# EAGLE design tusb wiggler - b conn (EAGLE 6.3)
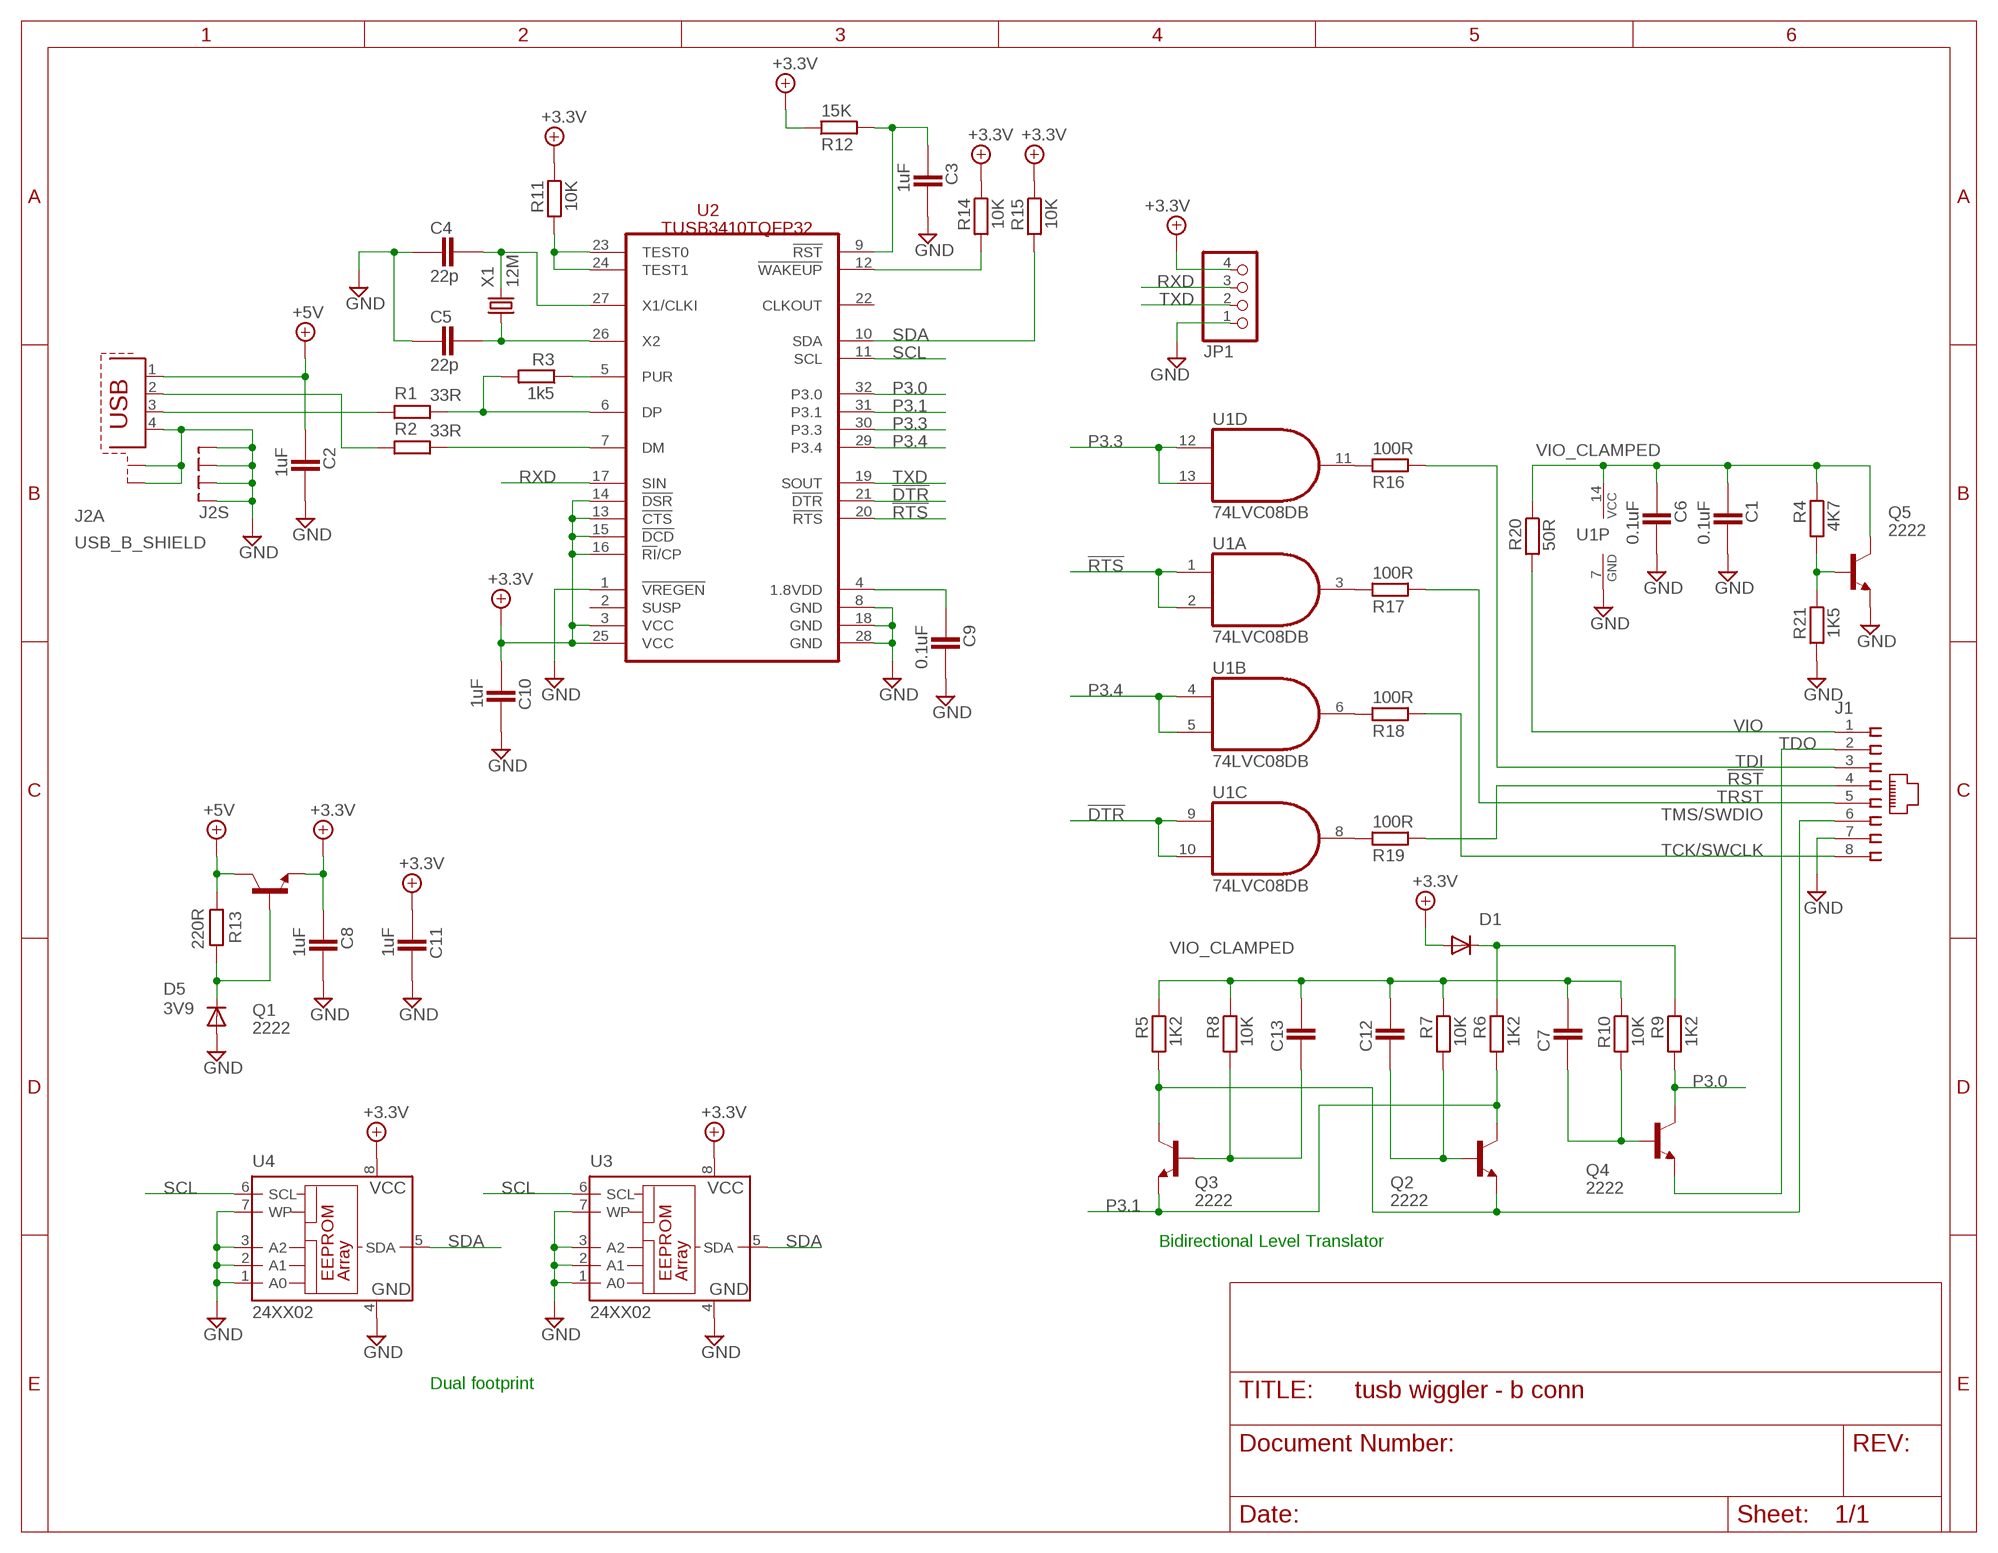
[diagram p0: schematic, sheet 1]

## Parts
C1  0.1uF  CAPACITOR_1206  [CAPC3215X168N]
C2  1uF  CAPACITOR_0603  [CAPC1608X92N]
C3  1uF  CAPACITOR_0603  [CAPC1608X92N]
C4  22p  CAPACITOR_0805N  [CAP2012X70N]
C5  22p  CAPACITOR_0805N  [CAP2012X70N]
C6  0.1uF  CAPACITOR_0603  [CAPC1608X92N]
C7  CAPACITOR_0805N  [CAP2012X70N]
C8  1uF  CAPACITOR_0603  [CAPC1608X92N]
C9  0.1uF  CAPACITOR_0805N  [CAP2012X70N]
C10  1uF  CAPACITOR_0603  [CAPC1608X92N]
C11  1uF  CAPACITOR_0603  [CAPC1608X92N]
C12  CAPACITOR_0805N  [CAP2012X70N]
C13  CAPACITOR_0805N  [CAP2012X70N]
D1  DIODE-SOD110-W  [SOD110-W]
D5  3V9  DIODE-MELF-MLL41  [MELF-MLL41]
J1  520426-4  [520426-4]
J2  USB_B_SHIELD  [PN61729-S]
JP1  PINHD-1X4_2.54  [1X04]
Q1  2222  NPN_SOT-23  [SOT95P280X135-3N]
Q2  2222  NPN_SOT-23  [SOT95P280X135-3N]
Q3  2222  NPN_SOT-23  [SOT95P280X135-3N]
Q4  2222  NPN_SOT-23  [SOT95P280X135-3N]
Q5  2222  NPN_SOT-23  [SOT95P280X135-3N]
R1  33R  RESISTOR_0603  [RESC1608X55N]
R2  33R  RESISTOR_0603  [RESC1608X55N]
R3  1k5  RESISTOR_0603  [RESC1608X55N]
R4  4K7  RESISTOR_0603  [RESC1608X55N]
R5  1K2  RESISTOR_0603  [RESC1608X55N]
R6  1K2  RESISTOR_0603  [RESC1608X55N]
R7  10K  RESISTOR_0603  [RESC1608X55N]
R8  10K  RESISTOR_0603  [RESC1608X55N]
R9  1K2  RESISTOR_0603  [RESC1608X55N]
R10  10K  RESISTOR_0603  [RESC1608X55N]
R11  10K  RESISTOR_0603  [RESC1608X55N]
R12  15K  RESISTOR_0603  [RESC1608X55N]
R13  220R  RESISTOR_0603  [RESC1608X55N]
R14  10K  RESISTOR_0603  [RESC1608X55N]
R15  10K  RESISTOR_0603  [RESC1608X55N]
R16  100R  RESISTOR_1206  [RESC3115X70N]
R17  100R  RESISTOR_1206  [RESC3115X70N]
R18  100R  RESISTOR_1206  [RESC3115X70N]
R19  100R  RESISTOR_1206  [RESC3115X70N]
R20  50R  RESISTOR_0603  [RESC1608X55N]
R21  1K5  RESISTOR_0603  [RESC1608X55N]
U1  74LVC08DB  7408DB  [TSSOP14]
U2  TUSB3410TQFP32  [TQFP32-08]
U3  24XX02  24AA64ST  [TSSOP8]
U4  24XX02  24AA64SN  [SO-08]
X1  12M  CRYSTALHC49UP  [HC49UP]

## Nets
!DTR: U1.9(C:I0) U1.10(C:I1) U2.21(!DTR)
!RST: J1.4 R19.2
!RTS: U1.1(A:I0) U1.2(A:I1) U2.20(!RTS)
+3.3V: C8.1 C10.1 C11.1 D1.A JP1.4 Q1.2(E) R11.1 R12.1 R14.1 R15.1 U2.3(VCC) U2.13(!CTS) U2.14(!DSR) U2.15(!DCD) U2.16(!RI!/CP) U2.25(VCC) U3.8(VCC) U4.8(VCC)
+5V: C2.1 J2.1 Q1.3(C) R13.1
GND: C1.2 C2.2 C3.2 C4.1 C5.1 C6.2 C8.2 C9.2 C10.2 C11.2 D5.A J1.7 J2.4 J2.G1(A:S1) J2.G2(S:S1) J2.G3(S:S2) J2.G4(A:S2) J2.G5(S:S3) J2.G6(S:S4) JP1.1 Q5.2(E) R21.2 U1.7(P:GND) U2.1(!VREGEN) U2.8(GND) U2.18(GND) U2.28(GND) U3.1(A0) U3.2(A1) U3.3(A2) U3.4(GND) U3.7(WP) U4.1(A0) U4.2(A1) U4.3(A2) U4.4(GND) U4.7(WP)
N$2: J2.3 R1.1
N$4: C12.1 Q2.1(B) R7.2
N$6: C7.1 Q4.1(B) R10.2
N$7: C13.1 Q3.1(B) R8.2
N$8: R19.1 U1.8(C:O)
N$9: R11.2 U2.23(TEST0) U2.24(TEST1)
N$10: C3.1 R12.2 U2.9(!RST)
N$11: R16.1 U1.11(D:O)
N$12: R17.1 U1.3(A:O)
N$13: R18.1 U1.6(B:O)
N$14: Q5.1(B) R4.2 R21.1
N$15: D1.C R6.1 R9.1
N$17: R14.2 U2.12(!WAKEUP)
N$18: J2.2 R2.1
N$22: R1.2 R3.2 U2.6(DP)
N$23: R2.2 U2.7(DM)
N$24: D5.C Q1.1(B) R13.2
N$25: C4.2 U2.27(X1/CLKI) X1.2
N$26: C5.2 U2.26(X2) X1.1
N$29: C9.1 U2.4(1.8VDD)
N$30: R3.1 U2.5(PUR)
P3.0: Q4.3(C) R9.2 U2.32(P3.0)
P3.1: Q2.3(C) Q3.2(E) R6.2 U2.31(P3.1)
P3.3: U1.12(D:I0) U1.13(D:I1) U2.30(P3.3)
P3.4: U1.4(B:I0) U1.5(B:I1) U2.29(P3.4)
RXD: JP1.3 U2.17(SIN)
SCL: U2.11(SCL) U3.6(SCL) U4.6(SCL)
SDA: R15.2 U2.10(SDA) U3.5(SDA) U4.5(SDA)
TCK/SWCLK: J1.8 R18.2
TDI: J1.3 R16.2
TDO: J1.2 Q4.2(E)
TMS/SWDIO: J1.6 Q2.2(E) Q3.3(C) R5.2
TRST: J1.5 R17.2
TXD: JP1.2 U2.19(SOUT)
VIO: J1.1 R20.2
VIO_CLAMPED: C1.1 C6.1 C7.2 C12.2 C13.2 Q5.3(C) R4.1 R5.1 R7.1 R8.1 R10.1 R20.1 U1.14(P:VCC)
Unconnected: U2.2(SUSP) U2.22(CLKOUT)

## Notes on the sheet
- Bidirectional Level Translator
- Dual footprint

## Library data of the parts
C1-C13 = ipc-7351-capacitor:CAPACITOR_
D1 D5 = diode:DIODE-: DIODE
J1 = con-amp:520426-4: AMP connector
J2 = Misc Conn:USB_B_SHIELD
JP1 = pinhead-1:PINHD-1X4: PIN HEADER
Q1-Q5 = ipc-7351-transistor:NPN_
R1-R21 = ipc-7351-resistor:RESISTOR_
U1 = Misc Logic:74*08: Quad 2-input AND gate
U2 = tusb3x10-1:TUSB3410: USB Controller full RS232 , IrDA, RS485 , 4 I/O integrated 8052 microcontroller 16kB RAM code , 2kB RAM data
U3 U4 = microchip:24*: Serial EEPROM I2C
X1 = crystal:CRYSTAL: CRYSTAL

## Board
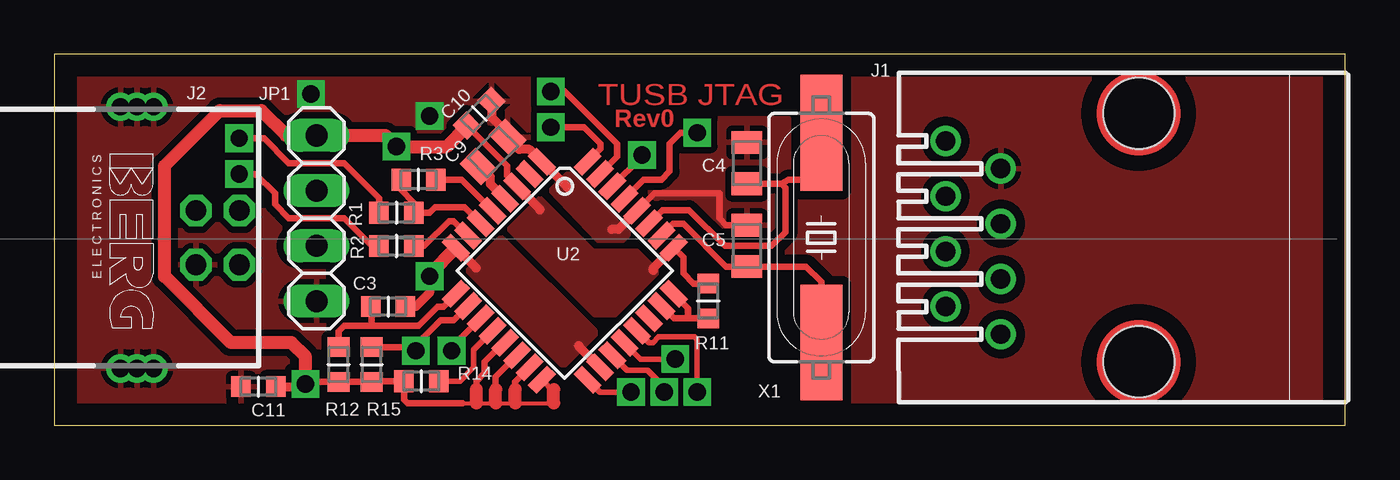
[diagram p1: board, top side]
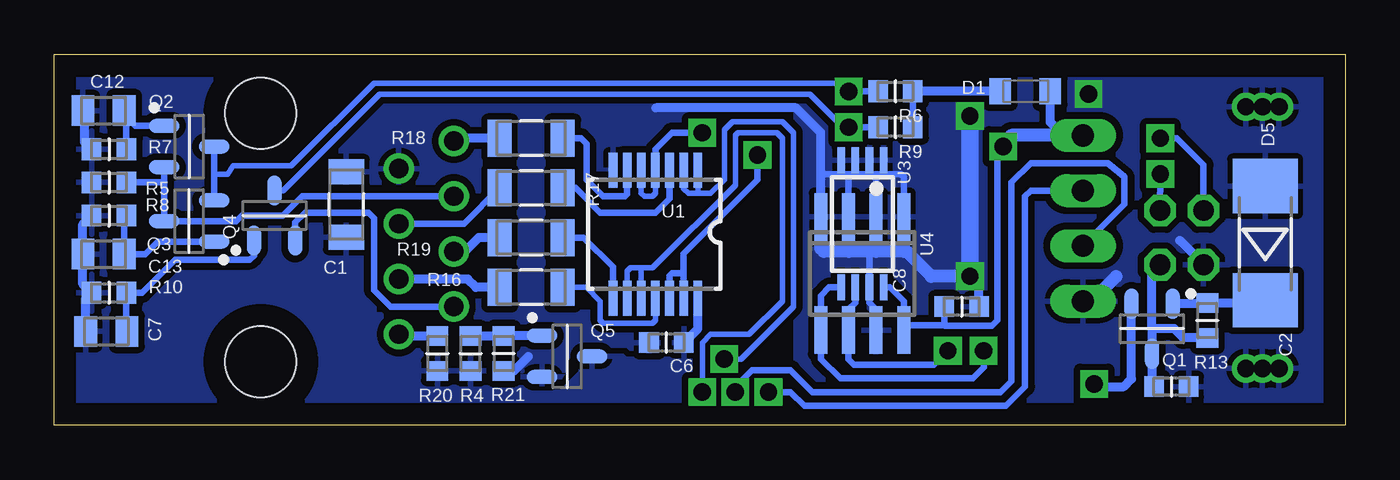
[diagram p2: board, bottom side, seen from below]

Size 59.42 x 17.07 mm. Coordinates in mm from the lower left corner, seen from the top.
Outline: 0,0 59.42,0 59.42,17.07 0,17.07 0,0
Copper layers (1*16): Top 0.035mm / dielectric 1.5mm / Bottom 0.035mm
Design rules "default *": minimum track width 10mil, minimum drill 24mil, track to track 8mil, track to pad 8mil, pad to pad 8mil, via to via 8mil, smd to smd 8mil, copper to edge 40mil, drill to drill 8mil, minimum pad ring 10mil, minimum via ring 8mil, stop-mask expansion 4mil, vias tented up to drill 0mil, thermal gap 10mil

### Footprints (pad centres in the part's own frame; a part is rotated, then mirrored left to right if it is on the bottom)
CAPC3215X168N = smd 1.15 x 1.65: 1 -1.5,0; 2 1.5,0
CAPC1608X92N = smd 0.9 x 0.95: 1 -0.8,0; 2 0.8,0
CAP2012X70N = smd 1.05 x 1.4: 1 -0.95,0; 2 0.95,0
SOD110-W = smd 1 x 1.2: A 1.15,0; C -1.15,0
MELF-MLL41 = smd 2.5 x 3: A 2.625,0; C -2.625,0
520426-4 = drill 0.889: 1 -4.445,6.35; 2 -3.175,8.89; 3 -1.905,6.35; 4 -0.635,8.89; 5 0.635,6.35; 6 1.905,8.89; 7 3.175,6.35; 8 4.445,8.89 | hole 3.251: -5.715,0; 5.715,0
PN61729-S = drill 0.95 octagon: 1 1.25,4.71; 2 -1.25,4.71; 3 -1.25,2.71; 4 1.25,2.71 | drill 0.8: G1 -6.02,0.762; G2 -6.02,0; G3 -6.02,-0.762; G4 6.02,0.762; G5 6.02,0; G6 6.02,-0.762
1X04 = drill 1.016 long: 1 -3.81,0; 2 -1.27,0; 3 1.27,0; 4 3.81,0
SOT95P280X135-3N = smd 1.4 x 0.65: 1 -1.15,0.95; 2 -1.15,-0.95; 3 1.15,0
RESC1608X55N = smd 0.9 x 1: 1 -0.8,0; 2 0.8,0
RESC3115X70N = smd 1.1 x 1.7: 1 -1.45,0; 2 1.45,0
TSSOP14 = smd 0.4 x 1.6: 1 -1.95,-2.851; 2 -1.3,-2.851; 3 -0.65,-2.851; 4 0,-2.851; 5 0.65,-2.851; 6 1.3,-2.851; 7 1.95,-2.851; 8 1.95,3.049; 9 1.3,3.049; 10 0.65,3.049; 11 0,3.049; 12 -0.65,3.049; 13 -1.3,3.049; 14 -1.95,3.049
TQFP32-08 = smd 1.27 x 0.559: 1 -4.293,2.8; 2 -4.293,2; 3 -4.293,1.2; 4 -4.293,0.4; 5 -4.293,-0.4; 6 -4.293,-1.2; 7 -4.293,-2; 8 -4.293,-2.8; 17 4.293,-2.8; 18 4.293,-2; 19 4.293,-1.2; 20 4.293,-0.4; 21 4.293,0.4; 22 4.293,1.2; 23 4.293,2; 24 4.293,2.8 | smd 0.559 x 1.27: 9 -2.8,-4.293; 10 -2,-4.293; 11 -1.2,-4.293; 12 -0.4,-4.293; 13 0.4,-4.293; 14 1.2,-4.293; 15 2,-4.293; 16 2.8,-4.293; 25 2.8,4.293; 26 2,4.293; 27 1.2,4.293; 28 0.4,4.293; 29 -0.4,4.293; 30 -1.2,4.293; 31 -2,4.293; 32 -2.8,4.293
TSSOP8 = smd 0.35 x 1.2: 1 -0.975,-2.925; 2 -0.325,-2.925; 3 0.325,-2.925; 4 0.975,-2.925; 5 0.975,2.925; 6 0.325,2.925; 7 -0.325,2.925; 8 -0.975,2.925
SO-08 = smd 0.6 x 2.2: 1 -1.905,-2.6; 2 -0.635,-2.6; 3 0.635,-2.6; 4 1.905,-2.6; 5 1.905,2.6; 6 0.635,2.6; 7 -0.635,2.6; 8 -1.905,2.6
HC49UP = smd 5.334 x 1.93: 1 -4.826,0; 2 4.826,0

### Placement (x,y rotation side)
C1  45.97,10.16 90 bottom
C2  8,1.78 0 bottom
C3  15.37,5.46 0 top
C4  31.88,12.06 270 top
C5  31.88,8.25 270 top
C6  31.24,3.81 180 bottom
C7  57.02,4.32 180 bottom
C8  17.65,5.46 0 bottom
C9  20.19,12.57 45 top
C10  19.56,14.35 45 top
C11  9.4,1.78 180 top
C12  57.15,14.48 180 bottom
C13  57.15,7.87 180 bottom
D1  14.73,15.37 0 bottom
D5  3.68,8.38 90 bottom
J1  49.91,8.64 90 top
J2  3.81,8.64 270 top
JP1  12.06,9.52 90 top
Q1  8.89,4.45 270 bottom
Q2  53.21,12.83 0 bottom
Q3  53.21,9.4 180 bottom
Q4  49.28,9.65 90 bottom
Q5  35.81,3.18 0 bottom
R1  15.75,9.78 0 top
R2  15.75,8.25 0 top
R3  16.76,11.3 180 top
R4  40.26,3.3 90 bottom
R5  56.9,11.18 0 bottom
R6  20.7,15.37 180 bottom
R7  56.9,12.7 0 bottom
R8  56.9,9.65 0 bottom
R9  20.7,13.72 180 bottom
R10  56.9,6.1 0 bottom
R11  30.1,5.71 270 top
R12  13.08,2.79 90 top
R13  6.35,4.83 90 bottom
R14  16.89,2.03 0 top
R15  14.61,2.79 90 top
R16  37.47,6.35 180 bottom
R17  37.47,10.92 180 bottom
R18  37.47,13.21 180 bottom
R19  37.47,8.64 180 bottom
R20  41.78,3.3 90 bottom
R21  38.73,3.3 270 bottom
U1  31.75,8.89 180 bottom
U2  23.5,7.11 315 top
U3  22.22,9.27 180 bottom
U4  22.22,6.98 180 bottom
X1  35.31,8.64 90 top

### Tracks (layer width: path | path; a pad name or v marks a point on that pad's centre or on a via)
!DTR  (via drill 0.8 pad 1.27)
  Top 0.254: v29.59,1.52 29.59,3.94 29.46,4.06 27.81,4.06 27.56,3.81 27.36,3.81 U2.21
  Bottom 0.254: v29.59,1.52 29.59,3.81 29.21,4.19 27.43,4.19 25.91,5.71 25.91,13.21 26.16,13.46 27.94,13.46 28.07,13.33 28.07,11.05 31.88,7.24 32.39,7.24 | U1.10 32.4,7.22 32.39,7.24 | U1.9 33.05,7.08 32.89,7.24 32.39,7.24
!RST
  Bottom 0.406: J1.4 40.51,8 39.88,8.64 R19.2
!RTS  (via drill 0.8 pad 1.27)
  Top 0.254: U2.20 26.99,3.05 v28.58,3.05
  Bottom 0.254: v28.58,3.05 27.81,3.05 25.4,5.46 25.4,13.46 25.91,13.97 28.19,13.97 28.58,13.59 28.58,11.3 29.21,10.67 29.8,10.67 | 29.8,10.67 U1.1 29.74,11.68 | 29.8,10.67 30.23,10.67 30.45,10.89 U1.2
+3.3V  (via drill 0.8 pad 1.27)
  Top 0.178: 22.99,1.02 21.21,1.02 20.32,1.02 19.43,1.02 18.8,1.02
  Top 0.254: U2.16 22.99,1.55 22.99,1.65
  Top 0.305: U2.3 20.83,11.48 20.83,11.94 18.99,13.77 C10.1 | U2.15 21.21,2 21.21,1.65 | U2.14 20.32,2.24 20.32,1.65 | U2.25 28.96,7.72 28.96,6.98 29.43,6.52 R11.1 | 18.8,1.02 16.26,1.02 16.09,1.18 R14.1 14.64,2.03 R15.1 R12.1 11.65,1.99 | U2.13 20.69,3.79 19.81,2.92 19.81,2.41 19.43,2.03 19.43,1.65
  Top 0.406: U2.25 27.56,7.22 27.56,7.11 | U2.3 22.35,9.95 22.35,9.91 | C11.1 11.43,1.78 v11.56,1.91 11.65,1.99
  Top 0.61: 22.99,1.02 22.99,1.65 | 21.21,1.02 21.21,1.65 | 20.32,1.02 20.32,1.65 | 18.99,13.77 18.05,12.83 v15.75,12.83 15.24,13.33 JP1.4 10.67,13.33 9.53,14.48 7.62,14.48 5.08,11.94 5.08,6.86 8.13,3.81 10.92,3.81 11.56,3.18 v11.56,1.91 | 19.43,1.02 19.43,1.65
  Bottom 0.305: v15.75,12.83 16,12.57 16,4.83 16.26,4.57 18.42,4.57 18.45,4.61 | U3.8 20.95,6.35 20.32,5.71 U4.8 | U4.8 20.25,4.57 | 18.45,4.61 C8.1 | 18.45,4.61 20.09,4.61 U4.8
  Bottom 0.406: Q1.2 9.84,2.14 C11.1 11.43,1.78 v11.56,1.91 | 12.95,13.33 13.58,13.96 D1.A
  Bottom 0.61: JP1.4 12.95,13.33 15.37,13.33 v15.75,12.83
  pour Top: 27.69,7.11 26.8,8 24.77,8 22.35,10.41 20.95,9.02 24.89,5.08 25.78,5.08 27.69,6.98
+5V
  Bottom 0.406: C2.1 8.89,1.87 Q1.3 8.89,4.45 | 8.89,4.45 8.89,7.02 J2.1 | R13.1 7.45,4.03 7.87,4.45 8.89,4.45
GND  (via drill 0.8 pad 1.27)
  Top 0.305: C5.1 30.93,9.2 30.61,9.52 30.61,10.67 27.62,10.67 U2.28
  Top 0.406: U2.8 19.41,7.24 19.43,7.24 | U2.18 24.13,3.65 24.13,3.68 | 23.62,10.95 U2.1 21.87,12.7 21.41,12.7 C9.2 | U2.28 25.97,9.02 25.65,9.02 | C10.2 20.12,14.17 20.95,13.33 | v17.27,6.86 17.27,6.1 16.64,5.46 C3.2
  Top 0.61: v17.27,6.86 17.27,6.96 U2.8
  Bottom 0.305: U4.7 21.59,5.33 21.9,5.64 U3.7 21.9,7.93 21.97,8 | U3.1 21.25,11.64 21.34,11.56 | 23.11,11.56 24,11.56 24.13,11.43 | 22.86,11.56 23.11,11.56 | 22.61,11.56 22.86,11.56 | 21.84,11.56 22.61,11.56 | 21.59,11.56 21.84,11.56 | 21.59,11.56 21.34,11.56 | U3.4 23.2,11.64 23.11,11.56 | U3.3 22.55,11.61 22.61,11.56 | U3.2 21.9,11.61 21.84,11.56 | U4.3 22.86,11.56 | U4.2 21.59,11.56 | 21.34,11.56 20.45,11.56 20.32,11.43 20.32,9.4
  Bottom 0.406: 22.86,8 U4.3 | 21.59,8 U4.2 | 20.32,8 20.32,9.4 U4.1 | C8.2 16.85,6.44 v17.27,6.86 | 31.72,14.61 25.27,14.61 24.13,13.46 24.13,11.43 24.13,9.27 | 6.6,7.37 6.6,7.49 7.62,8.51 | R21.2 38.27,2.5 37.59,3.18
  Bottom 0.61: U4.4 24.13,9.27 24.13,8.13 24,8 22.86,8 21.97,8 21.59,8 20.32,8 20.19,8 19.05,6.86 v17.27,6.86 | JP1.1 11.68,5.71 10.54,6.86
  Bottom 0.813: v17.27,6.86 v17.27,14.22
  other vias: 11.81,15.24
  pour Bottom (isolate 0.305): 30.35,14.99 30.35,11.81 36.58,11.81 36.58,3.18 40.51,3.18 40.51,11.18 46.23,11.18 46.23,14.99
  pour Top (isolate 0.305): 21.84,16.13 0.89,16.13 1.02,0.89 12.45,0.76 12.32,12.06 21.84,12.32
  pour Top: 24.89,4.32 20.57,8.64 19.05,7.11 23.37,2.79 23.5,2.79 24.89,4.19
  pour Top: 22.86,10.8 23.62,11.56 23.75,11.56 26.42,8.89 26.42,8.76 26.16,8.51 25.02,8.51
  pour Bottom (isolate 0.305): 0.89,16.13 25.27,16.13 25.27,0.89 1.02,0.89
  pour Top (isolate 0.406): 59.56,16.26 59.56,0.89 33.66,0.89 33.66,16.26
  pour Top (isolate 0.305): 33.78,14.1 33.78,8.76 27.05,8.76 27.05,14.1
  pour Bottom (isolate 0.305): 31.62,3.43 32.77,3.43 33.02,3.68 35.43,3.68 35.94,2.92 35.94,2.54 36.32,1.91 37.85,1.91 37.85,3.3 40.89,3.3 40.89,5.33 35.18,5.21 31.62,5.21
N$1  (via drill 1.1)
  other vias: 49.91,14.35
N$2  (via drill 0.8 pad 1.27)
  Top 0.305: v8.51,13.21 9.65,13.21 10.8,12.06 13.33,12.06 14.95,10.45 R1.1
  Bottom 0.305: v8.51,13.21 7.75,13.21 6.52,11.98 J2.3
N$4
  Bottom 0.305: Q2.1 55.69,13.78 55.94,14.03 | C12.1 56.2,14.29 55.94,14.03 | R7.2 56.1,13.88 55.94,14.03
N$5  (via drill 1.1)
  other vias: 49.91,2.92
N$6
  Bottom 0.305: Q4.1 50.23,7.81 50.42,7.62 53.85,7.62 55.37,6.1 R10.2 56.1,4.34 C7.1
N$7
  Bottom 0.305: Q3.1 54.67,8.45 55.24,7.87 C13.1 56.2,9.55 R8.2
N$8
  Bottom 0.305: U1.8 33.7,7.28 35.05,8.64 R19.1
N$9
  Top 0.305: 29.17,4.91 R11.2 | U2.24 29.17,5.39 29.17,4.91 | U2.23 28.52,4.91 29.17,4.91
N$10
  Top 0.305: U2.9 17.91,5.46 17.65,5.46 16.76,4.57 14.61,4.57 | 14.61,4.57 13.33,4.57 13.08,4.32 R12.2 | C3.1 14.61,5.42 14.61,4.57
N$11
  Bottom 0.254: U1.11 31.75,4.83 31.88,4.7 34.16,4.7 34.29,4.83 34.29,5.71 34.92,6.35 R16.1
N$12
  Bottom 0.305: U1.3 31.1,10.43 31.75,9.78 34.29,9.78 35.43,10.92 R17.1
N$13
  Bottom 0.305: U1.6 33.05,10.64 33.15,10.54 34.16,10.54 34.92,11.3 34.92,12.95 35.18,13.21 R18.1
N$14
  Bottom 0.406: R4.2 R21.1 38.2,4.12 Q5.1
N$15
  Bottom 0.305: R6.1 R9.1
  Bottom 0.406: D1.C R6.1
N$17
  Top 0.254: U2.12 19.3,3.49 19.3,2.67 18.67,2.03 R14.2
N$18  (via drill 0.8 pad 1.27)
  Top 0.305: v8.51,11.56 9.27,11.56 10.16,10.67 10.16,10.16 10.8,9.52 13.33,9.52 14.61,8.25 R2.1
  Bottom 0.305: J2.2 8.52,10.66 8.51,10.8 v8.51,11.56
N$22
  Top 0.305: U2.6 18.88,10.03 17.53,10.03 17.27,9.78 R1.2 16.55,10.25 15.96,10.83 R3.2
N$23
  Top 0.305: U2.7 18.38,9.4 18.16,9.4 17.02,8.25 R2.2
N$24
  Bottom 0.406: Q1.1 6.38,5.59 R13.2 3.81,5.63 D5.C
N$25
  Top 0.305: U2.27 27.99,9.91 29.21,9.91 30.86,8.25 33.02,8.25 33.66,8.89 33.66,10.93 33.47,11.11 | 33.47,11.11 C4.2 | X1.2 35.31,11.3 33.78,11.3 33.47,11.11
N$26
  Top 0.305: U2.26 28.48,9.27 28.96,9.27 30.92,7.3 C5.2 34.61,7.3 35.31,6.6 X1.1
N$29
  Top 0.406: U2.4 20.07,11.11 20.07,11.43 19.99,11.43 C9.1
N$30
  Top 0.305: R3.1 18.74,11.3 U2.5
P3.0  (via drill 0.8 pad 1.27)
  Top 0.305: U2.32 25.15,12.72 25.15,12.95 24.38,13.72 v22.86,13.72
  Bottom 0.254: Q4.3 48.89,10.8 44.45,15.24 24.64,15.24 23.11,13.72 v22.86,13.72
  Bottom 0.305: R9.2 v22.86,13.72
P3.1  (via drill 0.8 pad 1.27)
  Top 0.305: U2.31 25.91,12.35 25.91,12.95 23.5,15.37 v22.86,15.37
  Bottom 0.254: v22.86,15.37 23.24,15.75 44.7,15.75 48.51,11.94 51.18,11.94 51.43,11.56 52.06,11.56
  Bottom 0.305: v22.86,15.37 R6.2 | Q3.2 52.06,11.56 Q2.3
P3.3  (via drill 0.8 pad 1.27)
  Top 0.305: U2.30 27.05,12.37 v27.05,12.45
  Bottom 0.305: U1.13 30.45,6.98 | 30.45,6.98 30.45,7.9 27.05,11.3 v27.05,12.45 | U1.12 31.1,6.87 30.99,6.98 30.45,6.98
P3.4  (via drill 0.8 pad 1.27)
  Top 0.305: U2.29 27.12,11.3 27.94,11.3 28.32,11.68 28.32,12.95 28.83,13.46 v29.59,13.46
  Bottom 0.254: U1.4 31.75,10.67 31.88,10.54 32.26,10.54 32.4,10.68 U1.5
  Bottom 0.305: U1.4 31.75,12.7 30.99,13.46 v29.59,13.46
RXD  (via drill 0.8 pad 1.27)
  Top 0.254: U2.17 25.12,1.52 v26.54,1.52
  Bottom 0.305: v26.54,1.52 25.53,1.52 24.89,0.89 15.62,0.89 14.73,1.78 14.73,10.54 14.48,10.8 JP1.3
SCL  (via drill 0.8 pad 1.27)
  Top 0.305: U2.11 18.29,3.6 v18.29,3.43
  Bottom 0.305: v18.29,3.43 18.92,2.79 22.61,2.79 22.86,3.05 U4.6 22.86,5.33 22.55,5.64 U3.6
SDA  (via drill 0.8 pad 1.27)
  Top 0.305: U2.10 18.38,4.83 17.78,4.83 16.64,3.68 v16.64,3.43 16.47,3.59 R15.2
  Bottom 0.305: v16.64,3.43 16.64,2.67 17.14,2.16 23.24,2.16 24.13,3.05 U4.5 24.13,5.97 23.75,6.35 U3.5
TCK/SWCLK
  Bottom 0.406: R18.2 40.89,13.21 J1.8
TDI
  Bottom 0.406: J1.3 40.39,6.73 40.01,6.35 R16.2
TDO
  Bottom 0.305: J1.2 43.94,5.46 44.7,6.22 44.7,9.52 44.96,9.78 47.88,9.78 48.33,9.33 Q4.2
TMS/SWDIO
  Bottom 0.305: J1.6 48.01,10.54 48.89,9.65 50.8,9.65 51.05,9.4 Q3.3 54.36,11.05 | 54.36,11.05 Q2.2 | R5.2 54.49,11.18 54.36,11.05
TRST
  Bottom 0.305: J1.5 40.57,9.27 R17.2
TXD  (via drill 0.8 pad 1.27)
  Top 0.254: U2.19 26.37,2.54 27.3,2.54 28.07,1.78 v28.07,1.52
  Bottom 0.305: v28.07,1.52 28.07,1.78 27.3,2.54 25.53,2.54 24.51,1.52 15.88,1.52 15.37,2.03 15.37,11.18 14.48,12.06 10.92,12.06 10.16,11.43 10.16,10.16 JP1.2
VIO
  Bottom 0.406: R20.2 43.47,4.1 J1.1
VIO_CLAMPED
  Bottom 0.305: C12.2 58.04,14.42
  Bottom 0.406: U1.14 29.8,4.45 C6.1 | 58.04,14.42 58.04,13.04 R7.1 | R8.1 58.1,9.25 C13.2 58.1,6.5 R10.1 57.97,5.82 C7.2
  pour Bottom (isolate 0.305): 44.7,10.41 44.7,1.14 59.56,1.02 59.56,16.26 45.21,16.26 45.21,10.41
  pour Bottom (isolate 0.305): 38.73,5.08 38.73,1.02 47.5,1.14 47.5,5.08
  pour Bottom (isolate 0.305): 38.99,2.16 38.86,0.89 29.08,0.89 29.34,4.45 30.86,4.45 30.86,3.05 33.15,3.05 33.27,3.18 35.18,3.18 35.18,2.41 36.07,1.52 37.47,1.52 37.47,2.16
(copper drawn outside any net)
  shapes: Bottom circle x2, Top circle x2

### Text on the board
Top: TUSB JTAG | Rev0